# Altium schematic sheet comm.SchDoc
size A4
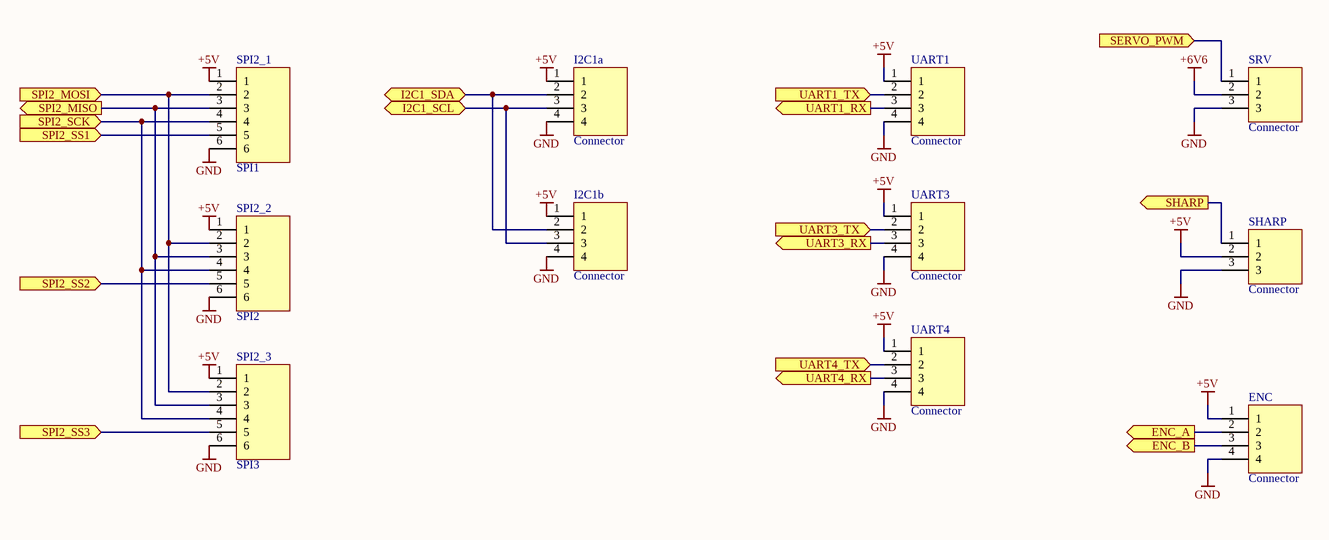
[diagram p0: comm.SchDoc]

## Parts
ENC  Connector  [FP_CONN4_TAP_254MM]
I2C1a  Connector  [FP_CONN4_TAP_254MM]
I2C1b  Connector  [FP_CONN4_TAP_254MM]
SHARP  Connector  [FP_CONN3_TAP_254MM]
SPI2_1  SPI1  [FP_CONN6_TAP_254MM]
SPI2_2  SPI2  [FP_CONN6_TAP_254MM]
SPI2_3  SPI3  [FP_CONN6_TAP_254MM]
SRV  Connector  [FP_CONN3_TAP_254MM]
UART1  Connector  [FP_CONN4_TAP_254MM]
UART3  Connector  [FP_CONN4_TAP_254MM]
UART4  Connector  [FP_CONN4_TAP_254MM]

## Ports
ENC_A (out), ENC_B (out), I2C1_SCL (bidir), I2C1_SDA (bidir), SERVO_PWM (in), SHARP (out), SPI2_MISO (out), SPI2_MOSI (in), SPI2_SCK (in), SPI2_SS1 (in), SPI2_SS2 (in), SPI2_SS3 (in), UART1_RX (out), UART1_TX (in), UART3_RX (out), UART3_TX (in), UART4_RX (out), UART4_TX (in)

## Nets
+5V: ENC.1 I2C1a.1 I2C1b.1 SHARP.2 SPI2_1.1 SPI2_2.1 SPI2_3.1 UART1.1 UART3.1 UART4.1
+6V6: SRV.2
GND: ENC.4 I2C1a.4 I2C1b.4 SHARP.3 SPI2_1.6 SPI2_2.6 SPI2_3.6 SRV.3 UART1.4 UART3.4 UART4.4
ENC_A: ENC.2 ; port ENC_A
ENC_B: ENC.3 ; port ENC_B
I2C1_SCL: I2C1a.3 I2C1b.3 ; port I2C1_SCL
I2C1_SDA: I2C1a.2 I2C1b.2 ; port I2C1_SDA
SERVO_PWM: SRV.1 ; port SERVO_PWM
SHARP: SHARP.1 ; port SHARP
SPI2_MISO: SPI2_1.3 SPI2_2.3 SPI2_3.3 ; port SPI2_MISO
SPI2_MOSI: SPI2_1.2 SPI2_2.2 SPI2_3.2 ; port SPI2_MOSI
SPI2_SCK: SPI2_1.4 SPI2_2.4 SPI2_3.4 ; port SPI2_SCK
SPI2_SS1: SPI2_1.5 ; port SPI2_SS1
SPI2_SS2: SPI2_2.5 ; port SPI2_SS2
SPI2_SS3: SPI2_3.5 ; port SPI2_SS3
UART1_RX: UART1.3 ; port UART1_RX
UART1_TX: UART1.2 ; port UART1_TX
UART3_RX: UART3.3 ; port UART3_RX
UART3_TX: UART3.2 ; port UART3_TX
UART4_RX: UART4.3 ; port UART4_RX
UART4_TX: UART4.2 ; port UART4_TX

## Library data of the parts
ENC I2C1a I2C1b UART1 UART3 UART4 = Connector_4pin: 4pin Connector
SHARP SRV = Connector_3pin: 3pin connector
SPI2_1-SPI2_3 = Connector_6pin: 6pin connector